# EAGLE design SpindlePID (EAGLE 6.3)
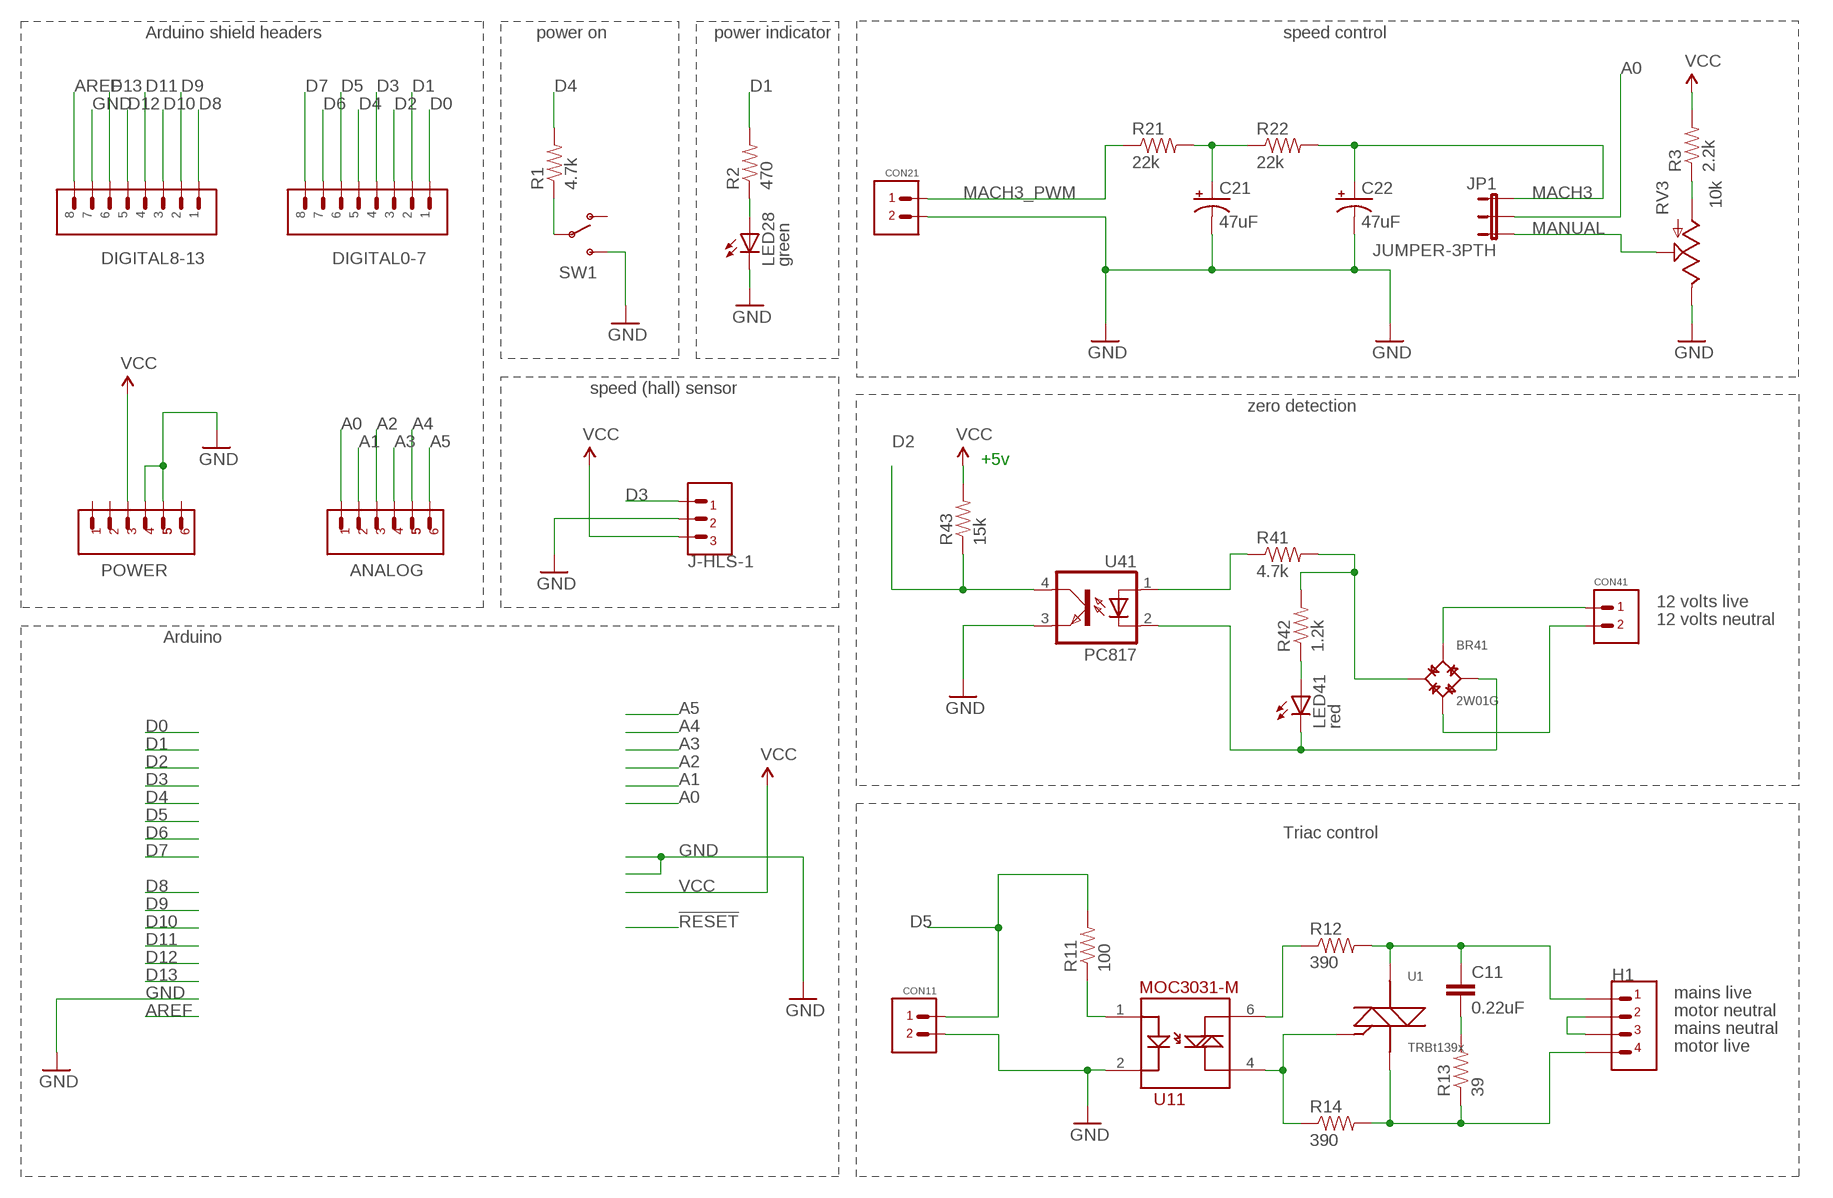
[diagram p0: schematic, sheet 1]

## Parts
ANALOG  6PINHEADER0.1"  [6PINHEADER]
BR41  2W01G  DIODEBRIDGE  [DIODEBRIDGE]
C11  0.22uF  CAPPTH  [CAP-PTH-SMALL]
C21  47uF  CAP_POLPTH2  [CPOL-RADIAL-10UF-25V]
C22  47uF  CAP_POLPTH2  [CPOL-RADIAL-10UF-25V]
CON11  2PINHEADER  [2PINHEADER]
CON21  2PINHEADER  [2PINHEADER]
CON41  2PINHEADER  [2PINHEADER]
DIGITAL0-7  8PINHEADER  [8PINHEADER]
DIGITAL8-13  8PINHEADER  [8PINHEADER]
H1  4PIN  [4PIN]
J-HLS-1  3PINHEADER  [3PINHEADER]
JP1  JUMPER-3PTH  [1X03]
LED28  green  LED5MM  [LED5MM]
LED41  red  LED5MM  [LED5MM]
POWER  6PINHEADER0.1"  [6PINHEADER]
R1  4.7k  RESISTORPTH-1/6W  [1/6W-RES]
R2  470  RESISTORPTH-1/6W  [1/6W-RES]
R3  2.2k  RESISTORPTH-1/6W  [1/6W-RES]
R11  100  RESISTORPTH-1/6W  [1/6W-RES]
R12  390  RESISTORPTH-1/6W  [1/6W-RES]
R13  39  RESISTORPTH-1/6W  [1/6W-RES]
R14  390  RESISTORPTH-1/6W  [1/6W-RES]
R21  22k  RESISTORPTH-1/6W  [1/6W-RES]
R22  22k  RESISTORPTH-1/6W  [1/6W-RES]
R41  4.7k  RESISTORPTH-1/6W  [1/6W-RES]
R42  1.2k  RESISTORPTH-1/6W  [1/6W-RES]
R43  15k  RESISTORPTH-1/6W  [1/6W-RES]
RV3  10k  POTTRIM  [TRIM_POT]
SW1  SWITCH-SPSTPTH  [SWITCH-SPDT]
U1  TRBt139x  TRIAC  [TRIAC]
U11  MOC3031-M  [DIL06]
U41  PC817  [DIL04]

## Nets
A0: ANALOG.P$1 JP1.2
A1: ANALOG.P$2
A2: ANALOG.P$3
A3: ANALOG.P$4
A4: ANALOG.P$5
A5: ANALOG.P$6
AREF: DIGITAL8-13.P$8
D0: DIGITAL0-7.P$1
D1: DIGITAL0-7.P$2 R2.2
D2: DIGITAL0-7.P$3 R43.1 U41.4(COL)
D3: DIGITAL0-7.P$4 J-HLS-1.P$3
D4: DIGITAL0-7.P$5 R1.2
D5: CON11.P$1 DIGITAL0-7.P$6 R11.2
D6: DIGITAL0-7.P$7
D7: DIGITAL0-7.P$8
D8: DIGITAL8-13.P$1
D9: DIGITAL8-13.P$2
D10: DIGITAL8-13.P$3
D11: DIGITAL8-13.P$4
D12: DIGITAL8-13.P$5
D13: DIGITAL8-13.P$6
GND: C21.2(-) C22.2(-) CON11.P$2 CON21.P$2 DIGITAL8-13.P$7 J-HLS-1.P$2 LED28.K(C) POWER.P$4 POWER.P$5 RV3.2(E) SW1.3(S) U11.2 U41.3(EMIT)
MACH3: C22.1(+) JP1.1 R22.2
MACH3_PWM: CON21.P$1 R21.1
MAINS_LIVE: C11.1 H1.P$1 R12.2 U1.2(A)
MANUAL: JP1.3 RV3.1(S)
MOTOR_LIVE: H1.P$4 R13.1 R14.2 U1.3(C)
N$2: C21.1(+) R21.2 R22.1
N$3: R14.1 U1.1(B) U11.4
N$4: LED28.A R2.1
N$5: C11.2 R13.2
N$6: LED41.A R42.1
N$7: R41.1 U41.1(A)
N$8: BR41.- LED41.K(C) U41.2(C)
N$9: BR41.+ R41.2 R42.2
N$10: R3.1 RV3.3(A)
N$12: R1.1 SW1.2(P)
N$13: R11.1 U11.1
N$14: BR41.AC1 CON41.P$1
N$15: R12.1 U11.6
N$16: BR41.AC2 CON41.P$2
NEUTRAL: H1.P$2 H1.P$3
VCC: J-HLS-1.P$1 POWER.P$3 R3.2 R43.2
Unconnected: POWER.P$1 POWER.P$2 POWER.P$6 SW1.1(O)

## Notes on the sheet
- Arduino shield headers | power on | power indicator | speed control
- speed (hall) sensor
- zero detection
- +5v
- 12 volts live
- 12 volts neutral
- Arduino
- Triac control
- mains live
- motor neutral
- mains neutral
- motor live

## Library data of the parts
ANALOG POWER = connectors:6PINHEADER
BR41 = connectors:DIODEBRIDGE
C11 = SparkFun:CAP: Capacitor Standard 0603 ceramic capacitor, and 0.1" leaded capacitor.
C21 C22 = SparkFun:CAP_POL: Capacitor Polarized These are standard SMD and PTH capacitors. Normally 10uF, 47uF, and 100uF in electrolytic and tantalum varieties. Always verify the external diameter of the through hole cap, it varies with capacity, voltage, and manufacturer. The EIA devices should be standard.
CON11 CON21 CON41 = connectors:2PINHEADER: 2pin header 0.1" pitch
DIGITAL0-7 DIGITAL8-13 = connectors:8PINHEADER
H1 = connectors:4PIN
J-HLS-1 = connectors:3PINHEADER
JP1 = SparkFun:JUMPER-3
LED28 LED41 = adafruit2012:LED: LED OSRAM: - CHIPLED LG R971, LG N971, LY N971, LG Q971, LY Q971, LO R971, LY R971 LH N974, LH R974 LS Q976, LO Q976, LY Q976 LO Q996 - Hyper CHIPLED LW Q18S LB Q993, LB Q99A, LB R99A - SideLED LS A670, LO A670, LY A670, LG A670, LP A670 LB A673, LV A673, LT A673, LW A673 LH A674 LY A675 LS A676, LA A676, LO A676, LY A676, LW A676 LS A679, LY A679, LG A679 - Hyper Micro SIDELED® LS Y876, LA Y876, LO Y876, LY Y876 LT Y87S - SmartLED LW L88C, LW L88S LB L89C, LB L89S, LG L890 LS L89K, LO L89K, LY L89K LS L896, LA L896, LO L896, LY L896 - TOPLED LS T670, LO T670, LY T670, LG T670, LP T670 LSG T670, LSP T670, LSY T670, LOP T670, LYG T670 LG T671, LOG T671, LSG T671 LB T673, LV T673, LT T673, LW T673 LH T674 LS T676, LA T676, LO T676, LY T676, LB T676, LH T676, LSB T676, LW T676 LB T67C, LV T67C, LT T67C, LS T67K, LO T67K, LY T67K, LW E67C LS E67B, LA E67B, LO E67B, LY E67B, LB E67C, LV E67C, LT E67C LW T67C LS T679, LY T679, LG T679 LS T770, LO T770, LY T770, LG T770, LP T770 LB T773, LV T773, LT T773, LW T773 LH T774 LS E675, LA E675, LY E675, LS T675 LS T776, LA T776, LO T776, LY T776, LB T776 LHGB T686 LT T68C, LB T68C - Hyper Mini TOPLED® LB M676 - Mini TOPLED Santana® LG M470 LS M47K, LO M47K, LY M47K Source: http://www.osram.convergy.de/
R1-R3 R11-R14 R21 R22 R41-R43 = SparkFun:RESISTOR: Resistor Basic schematic elements and footprints for 0603, 1206, and PTH resistors.
RV3 = SparkFun:POT
SW1 = SparkFun:SWITCH-SPST: SPST Switch Simple slide switch. Spark Fun Electronics SKU : COM-00102
U1 = connectors:TRIAC
U11 = SparkFun:MOC3031-M
U41 = optocoupler:PC817: SHARP OPTO COUPLER; MPN: PC817X4J000F; OC_FARNELL: 9707727; OC_NEWARK: 97K7059

## Board
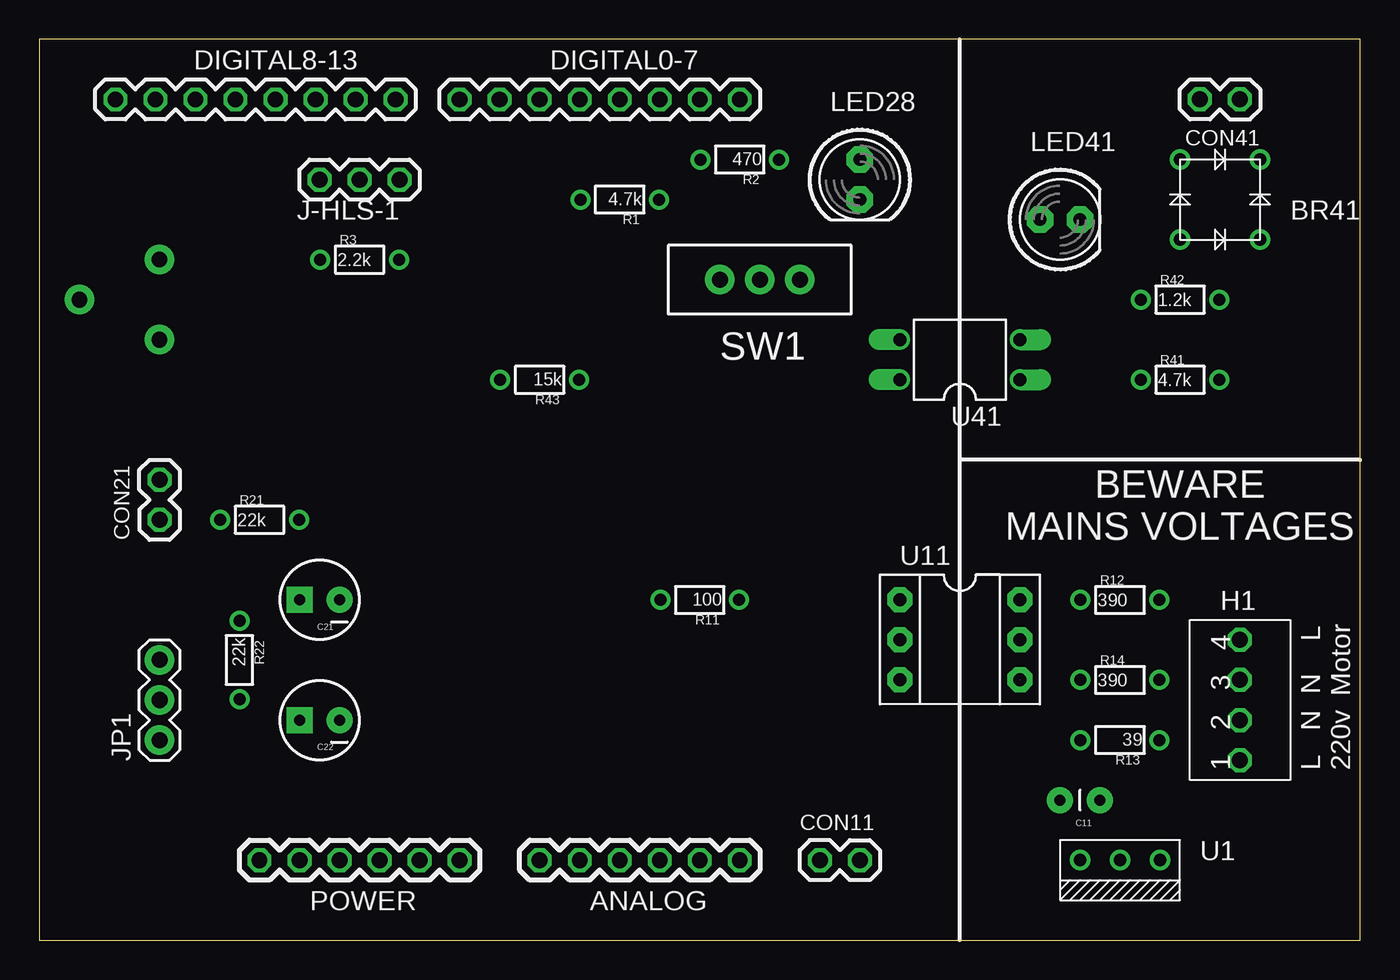
[diagram p1: board, top side]
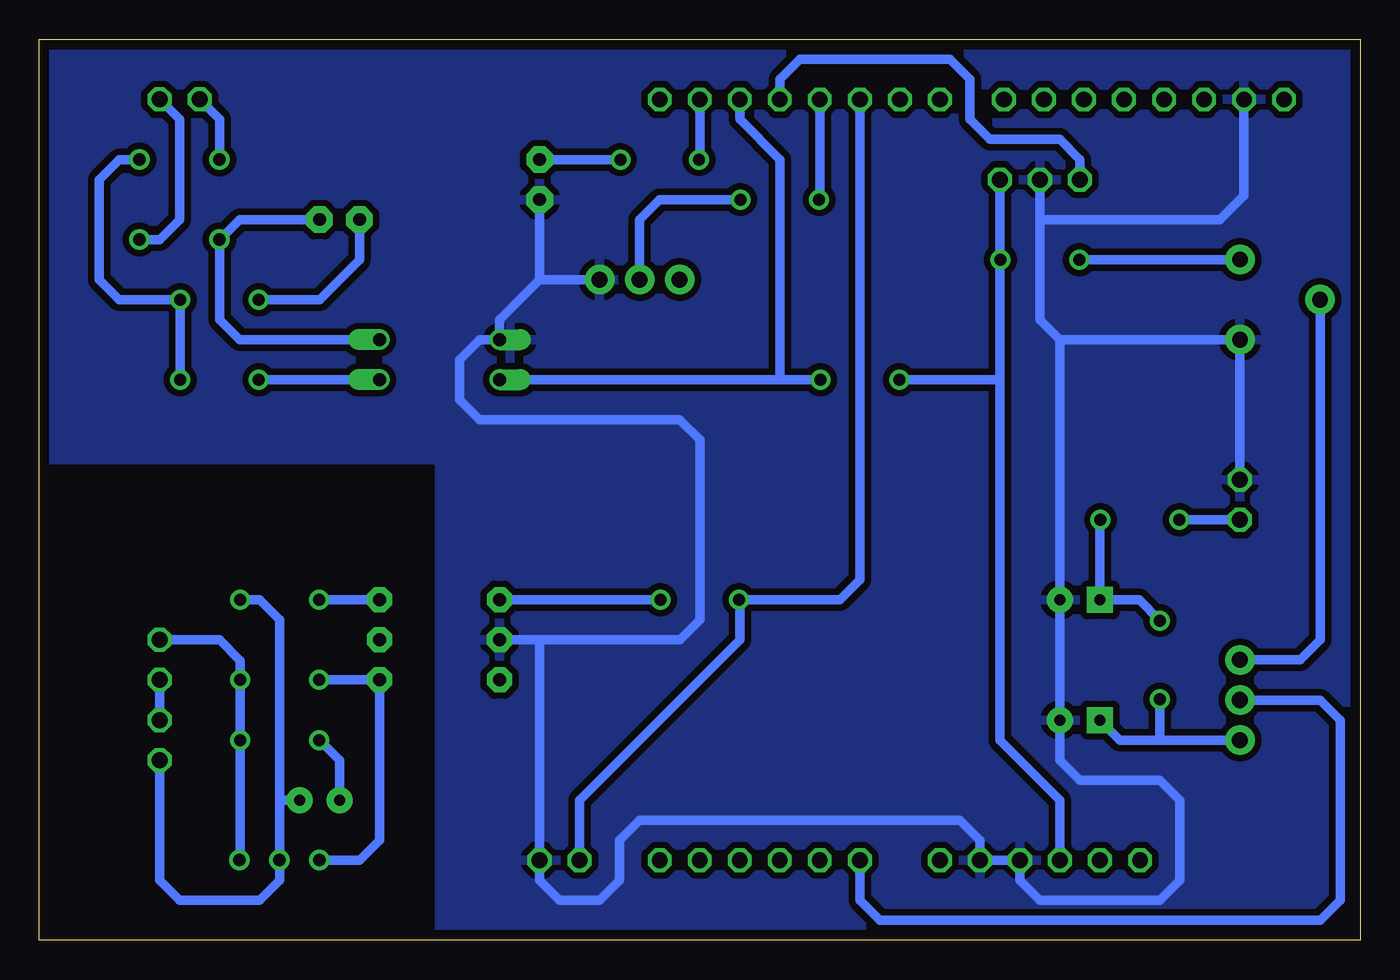
[diagram p2: board, bottom side, seen from below]

Size 83.82 x 57.15 mm. Coordinates in mm from the lower left corner, seen from the top.
Outline: 0,0 83.82,0 83.82,57.15 0,57.15 0,0
Copper layers (1*16): Top 0.035mm / dielectric 1.5mm / Bottom 0.035mm
Design rules "default *": minimum track width 10mil, minimum drill 24mil, track to track 16mil, track to pad 16mil, pad to pad 16mil, via to via 8mil, smd to smd 8mil, copper to edge 25mil, drill to drill 16mil, minimum pad ring 10mil, minimum via ring 8mil, stop-mask expansion 4mil, vias tented up to drill 0mil, thermal gap 16mil

### Footprints (pad centres in the part's own frame; a part is rotated, then mirrored left to right if it is on the bottom)
6PINHEADER = drill 1 octagon: P$1 -6.35,0; P$2 -3.81,0; P$3 -1.27,0; P$4 1.27,0; P$5 3.81,0; P$6 6.35,0
DIODEBRIDGE = drill 0.8: + -2.54,2.54; - 2.54,-2.54; AC1 2.54,2.54; AC2 -2.54,-2.54
CAP-PTH-SMALL = drill 0.7 pad 1.651: 1 0,0; 2 2.54,0
CPOL-RADIAL-10UF-25V = drill 0.7 pad 1.651 square: 1 1.27,0 | drill 0.7 pad 1.651: 2 -1.27,0
2PINHEADER = drill 1.016 octagon: P$1 -1.27,0; P$2 1.27,0
8PINHEADER = drill 1 octagon: P$1 -8.89,0; P$2 -6.35,0; P$3 -3.81,0; P$4 -1.27,0; P$5 1.27,0; P$6 3.81,0; P$7 6.35,0; P$8 8.89,0
4PIN = drill 1.016 octagon: P$1 -3.81,0; P$2 -1.27,0; P$3 1.27,0; P$4 3.81,0
3PINHEADER = drill 1.016 octagon: P$1 -5.08,0; P$2 -2.54,0; P$3 0,0
1X03 = drill 1.016 pad 1.88: 1 0,0; 2 2.54,0; 3 5.08,0
LED5MM = drill 0.813 pad 1.676 octagon: A -1.27,0; K 1.27,0
1/6W-RES = drill 0.762: 1 -2.5,0; 2 2.5,0
TRIM_POT = drill 1 pad 1.88: 1 5.08,0; 2 0,2.54; 3 0,-2.54
SWITCH-SPDT = drill 1.016 pad 1.88: 1 0,2.54; 2 0,0; 3 0,-2.54
TRIAC = drill 0.8: 1 -2.54,0; 2 0,0; 3 2.54,0
DIL06 = drill 0.813 pad 1.6 octagon: 1 -3.51,-3.81; 2 -0.97,-3.81; 3 1.57,-3.81; 4 1.57,3.81; 5 -0.97,3.81; 6 -3.51,3.81
DIL04 = drill 0.813 offset: 1 -1.27,-3.81; 2 1.27,-3.81; 3 1.27,3.81; 4 -1.27,3.81

### Placement (x,y rotation side)
ANALOG  38.1,5.08 0 top
BR41  74.93,46.99 270 top
C11  67.31,8.89 180 top
C21  17.78,21.59 180 top
C22  17.78,13.97 180 top
CON11  50.8,5.08 0 top
CON21  7.62,27.94 90 top
CON41  74.93,53.34 180 top
DIGITAL0-7  35.56,53.34 180 top
DIGITAL8-13  13.72,53.34 180 top
H1  76.2,15.24 90 top
J-HLS-1  17.78,48.26 180 top
JP1  7.62,12.7 90 top
LED28  52.07,48.26 270 top
LED41  64.77,45.72 0 top
POWER  20.32,5.08 0 top
R1  36.83,46.99 180 top
R2  44.45,49.53 180 top
R3  20.32,43.18 0 top
R11  41.91,21.59 180 top
R12  68.58,21.59 0 top
R13  68.58,12.7 180 top
R14  68.58,16.51 0 top
R21  13.97,26.67 0 top
R22  12.7,17.78 270 top
R41  72.39,35.56 0 top
R42  72.39,40.64 0 top
R43  31.75,35.56 180 top
RV3  7.62,40.64 180 top
SW1  45.72,41.91 90 top
U1  68.58,5.08 0 top
U11  58.42,18.1 270 top
U41  58.42,36.83 90 top

### Tracks (layer width: path | path; a pad name or v marks a point on that pad's centre or on a via)
A0
  Bottom 0.61: ANALOG.P$1 31.75,2.54 30.48,1.27 2.54,1.27 1.27,2.54 1.27,13.97 2.54,15.24 JP1.2
D1
  Bottom 0.61: DIGITAL0-7.P$2 41.91,49.53 R2.2
D2
  Bottom 0.61: U41.4 36.83,35.56 | 36.83,35.56 36.83,49.53 39.37,52.07 DIGITAL0-7.P$3 | 36.83,35.56 R43.1
D3
  Bottom 0.61: DIGITAL0-7.P$4 36.83,54.61 35.56,55.88 26.04,55.88 24.77,54.61 24.77,52.07 23.5,50.8 19.05,50.8 17.78,49.53 J-HLS-1.P$3
D4
  Bottom 0.61: DIGITAL0-7.P$5 34.29,47.03 R1.2
D5
  Bottom 0.61: DIGITAL0-7.P$6 31.75,22.86 33.02,21.59 R11.2 39.37,21.55 39.37,19.05 49.53,8.89 CON11.P$1
GND
  Bottom 0.61: LED28.K 52.07,41.91 | SW1.3 52.07,41.91 | 52.07,41.91 54.61,39.37 U41.3 55.88,38.1 57.15,36.83 57.15,34.29 55.88,33.02 43.18,33.02 41.91,31.75 41.91,20.32 43.16,19.07 52.07,19.07 | 19.05,38.1 RV3.2 CON21.P$2 | 19.05,38.1 20.32,39.37 20.32,45.72 | 20.32,45.72 J-HLS-1.P$2 | 19.05,38.1 C21.2 C22.2 19.05,11.43 17.78,10.16 12.7,10.16 11.43,8.89 11.43,3.81 12.7,2.54 20.32,2.54 21.59,3.81 POWER.P$4 POWER.P$5 24.13,6.35 25.4,7.62 45.72,7.62 46.99,6.35 46.99,3.81 48.26,2.54 50.8,2.54 52.07,3.81 CON11.P$2 52.07,19.07 | DIGITAL8-13.P$7 7.37,47.24 8.89,45.72 20.32,45.72 | 52.07,19.07 U11.2
  pour Bottom: -1.27,58.42 85.09,58.42 85.09,30.48 58.42,30.48 58.42,-1.27 -1.27,-1.27
MACH3
  Bottom 0.61: JP1.1 12.7,12.7 | 12.7,12.7 R22.2 | C22.1 15.24,12.7 12.7,12.7
MACH3_PWM
  Bottom 0.61: CON21.P$1 R21.1
MAINS_LIVE
  Bottom 0.61: C11.1 68.58,8.89 | 68.58,8.89 68.58,20.32 69.85,21.59 R12.2 | 68.58,8.89 U1.2 68.58,3.81 69.85,2.54 74.93,2.54 76.2,3.81 H1.P$1
MANUAL
  Bottom 0.61: JP1.3 3.81,17.78 2.54,19.05 RV3.1
MOTOR_LIVE
  Bottom 0.61: H1.P$4 72.39,19.05 71.08,17.74 R14.2 R13.1 71.08,5.12 U1.3
N$2
  Bottom 0.61: R22.1 14.01,21.59 C21.1 16.51,26.63 R21.2
N$3  (1 unrouted)
  Bottom 0.61: 62.23,16.51 62.23,6.35 63.5,5.08 U1.1 | U11.4 66.06,16.53 R14.1
N$4
  Bottom 0.61: LED28.A R2.1
N$5
  Bottom 0.61: C11.2 64.77,11.43 66.04,12.7 R13.2
N$6
  Bottom 0.61: LED41.A 63.5,43.18 66.04,40.64 R42.1
N$7
  Bottom 0.61: U41.1 R41.1
N$8
  Bottom 0.61: LED41.K 71.12,45.72 BR41.- 72.39,39.37 71.12,38.1 U41.2
N$9
  Bottom 0.61: BR41.+ 78.74,49.53 80.01,48.26 80.01,41.91 78.74,40.64 R42.2 R41.2
N$10
  Bottom 0.61: RV3.3 R3.1
N$12
  Bottom 0.61: SW1.2 45.72,45.72 44.45,46.99 R1.1
N$13
  Bottom 0.61: U11.1 44.43,21.61 R11.1
N$14
  Bottom 0.61: CON41.P$1 74.93,52.07 74.93,45.72 76.2,44.45 BR41.AC1
N$15
  Bottom 0.61: U11.6 66.06,21.61 R12.1
N$16
  Bottom 0.61: CON41.P$2 72.39,52.07 BR41.AC2
NEUTRAL
  Bottom 0.61: H1.P$3 H1.P$2
VCC
  Bottom 0.61: J-HLS-1.P$1 22.86,43.22 R3.2 22.86,43.14 22.86,35.56 | POWER.P$3 19.05,8.89 22.86,12.7 22.86,35.56 | R43.2 22.86,35.56

### Text on the board
tPlace: BEWARE / MAINS VOLTAGES | N L / Motor | L N / 220v